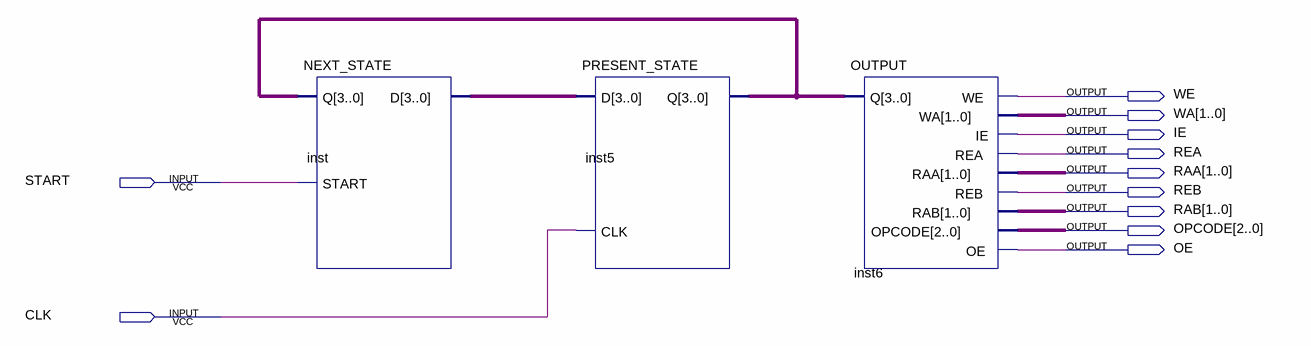
[diagram p0: schematic sheet]
// Quartus schematic Simple_Processor_CONTROLLER.bdf as structural Verilog: 3 symbols, 11 pins
module Simple_Processor_CONTROLLER (
  input  START,
  input  CLK,
  output WE,
  output [1:0] WA,
  output IE,
  output REA,
  output [1:0] RAA,
  output REB,
  output [1:0] RAB,
  output [2:0] OPCODE,
  output OE
);

  wire [3:0] inst5_q, inst_d;

  NEXT_STATE inst (.START(START), .Q(inst5_q), .D(inst_d));
  PRESENT_STATE inst5 (.CLK(CLK), .D(inst_d), .Q(inst5_q));
  OUTPUT inst6 (
    .Q(inst5_q), .WE(WE), .WA(WA), .IE(IE), .REA(REA), .RAA(RAA), .REB(REB), .RAB(RAB), .OPCODE(OPCODE),
    .OE(OE));
endmodule
